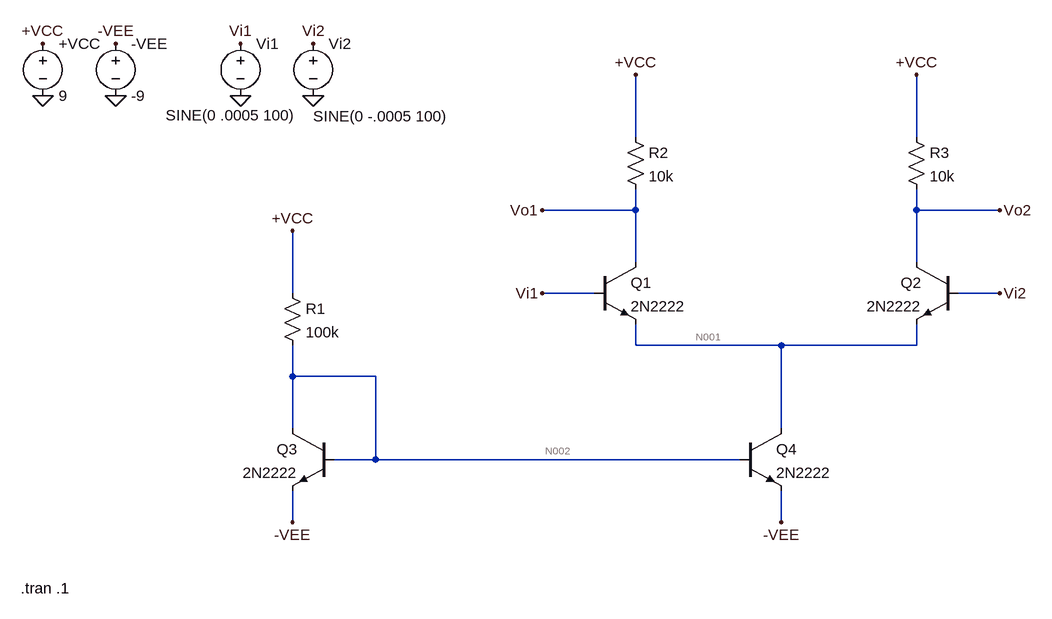
[diagram p0: schematic Draft1.asc]
Draft1.asc, the LTspice schematic file:
Version 4
SHEET 1 880 680
WIRE 64 -96 64 -192
WIRE 496 -96 496 -192
WIRE 64 16 64 -16
WIRE 64 16 -80 16
WIRE 496 16 496 -16
WIRE 624 16 496 16
WIRE 64 96 64 16
WIRE 496 96 496 16
WIRE -464 144 -464 48
WIRE 0 144 -80 144
WIRE 624 144 560 144
WIRE 64 224 64 192
WIRE 288 224 64 224
WIRE 496 224 496 192
WIRE 496 224 288 224
WIRE -464 272 -464 224
WIRE -336 272 -464 272
WIRE -464 352 -464 272
WIRE 288 352 288 224
WIRE -336 400 -336 272
WIRE -336 400 -400 400
WIRE 224 400 -336 400
WIRE -464 496 -464 448
WIRE 288 496 288 448
FLAG -464 496 -VEE
FLAG 288 496 -VEE
FLAG 64 -192 +VCC
FLAG 496 -192 +VCC
FLAG -464 48 +VCC
FLAG 624 16 Vo2
FLAG -80 16 Vo1
FLAG -80 144 Vi1
FLAG 624 144 Vi2
FLAG -432 -240 Vi2
FLAG -848 -240 +VCC
FLAG -736 -240 -VEE
FLAG -848 -160 0
FLAG -736 -160 0
FLAG -544 -160 0
FLAG -432 -160 0
FLAG -544 -240 Vi1
SYMBOL npn 0 96 R0
SYMATTR InstName Q1
SYMATTR Value 2N2222
SYMBOL npn 560 96 M0
SYMATTR InstName Q2
SYMATTR Value 2N2222
SYMBOL npn -400 352 M0
SYMATTR InstName Q3
SYMATTR Value 2N2222
SYMBOL npn 224 352 R0
SYMATTR InstName Q4
SYMATTR Value 2N2222
SYMBOL res -480 128 R0
SYMATTR InstName R1
SYMATTR Value 100k
SYMBOL res 48 -112 R0
SYMATTR InstName R2
SYMATTR Value 10k
SYMBOL res 480 -112 R0
SYMATTR InstName R3
SYMATTR Value 10k
SYMBOL voltage -848 -256 R0
WINDOW 123 0 0 Left 0
WINDOW 39 0 0 Left 0
SYMATTR InstName +VCC
SYMATTR Value 9
SYMBOL voltage -736 -256 R0
WINDOW 123 0 0 Left 0
WINDOW 39 0 0 Left 0
SYMATTR InstName -VEE
SYMATTR Value -9
SYMBOL voltage -544 -256 R0
WINDOW 3 -115 126 Left 2
WINDOW 123 0 0 Left 0
WINDOW 39 0 0 Left 0
SYMATTR InstName Vi1
SYMATTR Value SINE(0 .0005 100)
SYMBOL voltage -432 -256 R0
WINDOW 3 0 128 Left 2
WINDOW 123 0 0 Left 0
WINDOW 39 0 0 Left 0
SYMATTR InstName Vi2
SYMATTR Value SINE(0 -.0005 100)
TEXT -882 598 Left 2 !.tran .1

The netlist it stands for:
* Draft1.asc
Q1 Vo1 Vi1 N001 0 2N2222
Q2 Vo2 Vi2 N001 0 2N2222
Q3 N002 N002 -VEE 0 2N2222
Q4 N001 N002 -VEE 0 2N2222
R1 +VCC N002 100k
R2 +VCC Vo1 10k
R3 +VCC Vo2 10k
V§+VCC +VCC 0 9
V§-VEE -VEE 0 -9
Vi1 Vi1 0 SINE(0 .0005 100)
Vi2 Vi2 0 SINE(0 -.0005 100)
.model NPN NPN
.model PNP PNP
.lib standard.bjt
.tran .1
.backanno
.end

* Results of the author's LTspice run, read from the files saved beside the schematic
* Operating Point, zero values left out:
*   V(vo1) = 8.076 V
*   V(n001) = -591.5 mV
*   V(vo2) = 8.076 V
*   V(n002) = -8.39 V
*   V(-vee) = -9 V
*   V(+vcc) = 9 V
*   Ic(Q4) = 185.6 µA
*   Ib(Q4) = 861.3 nA
*   Ie(Q4) = -186.5 µA
*   Ic(Q3) = 172.2 µA
*   Ib(Q3) = 861.4 nA
*   Ie(Q3) = -173 µA
*   Ic(Q2) = 92.37 µA
*   Ib(Q2) = 427.4 nA
*   Ie(Q2) = -92.79 µA
*   Ic(Q1) = 92.37 µA
*   Ib(Q1) = 427.4 nA
*   Ie(Q1) = -92.79 µA
*   I(R3) = 92.37 µA
*   I(R2) = 92.37 µA
*   I(R1) = 173.9 µA
*   I(Vi2) = -427.4 nA
*   I(Vi1) = -427.4 nA
*   I(-vee) = 359.5 µA
*   I(+vcc) = -358.6 µA
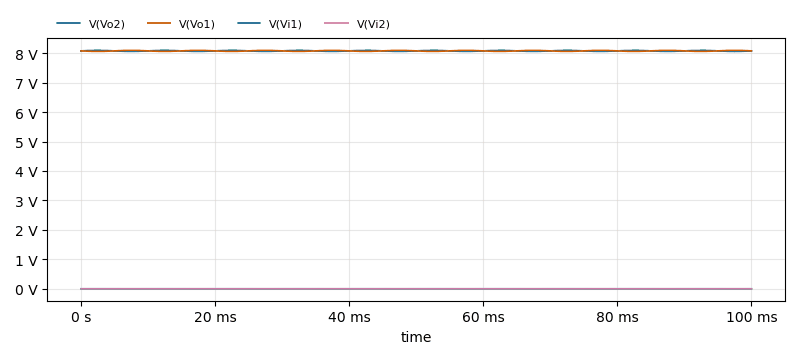
[diagram p1: Transient Analysis of Draft1.asc, plotted from the saved traces]
* Transient Analysis, 1 run:
*   V(Vo2): min 8.059 V, max 8.094 V, average 8.076 V, rms 8.076 V, last 8.076 V
*   V(Vo1): min 8.059 V, max 8.094 V, average 8.076 V, rms 8.076 V, last 8.076 V
*   V(Vi1): min -499.5 µV, max 498.4 µV, average -486.2 nV, rms 348.8 µV, last 0 V
*   V(Vi2): min -498.4 µV, max 499.5 µV, average 486.2 nV, rms 348.8 µV, last 0 V